# Altium project BACKPMAN21.PrjPcb (part 1 of 3)
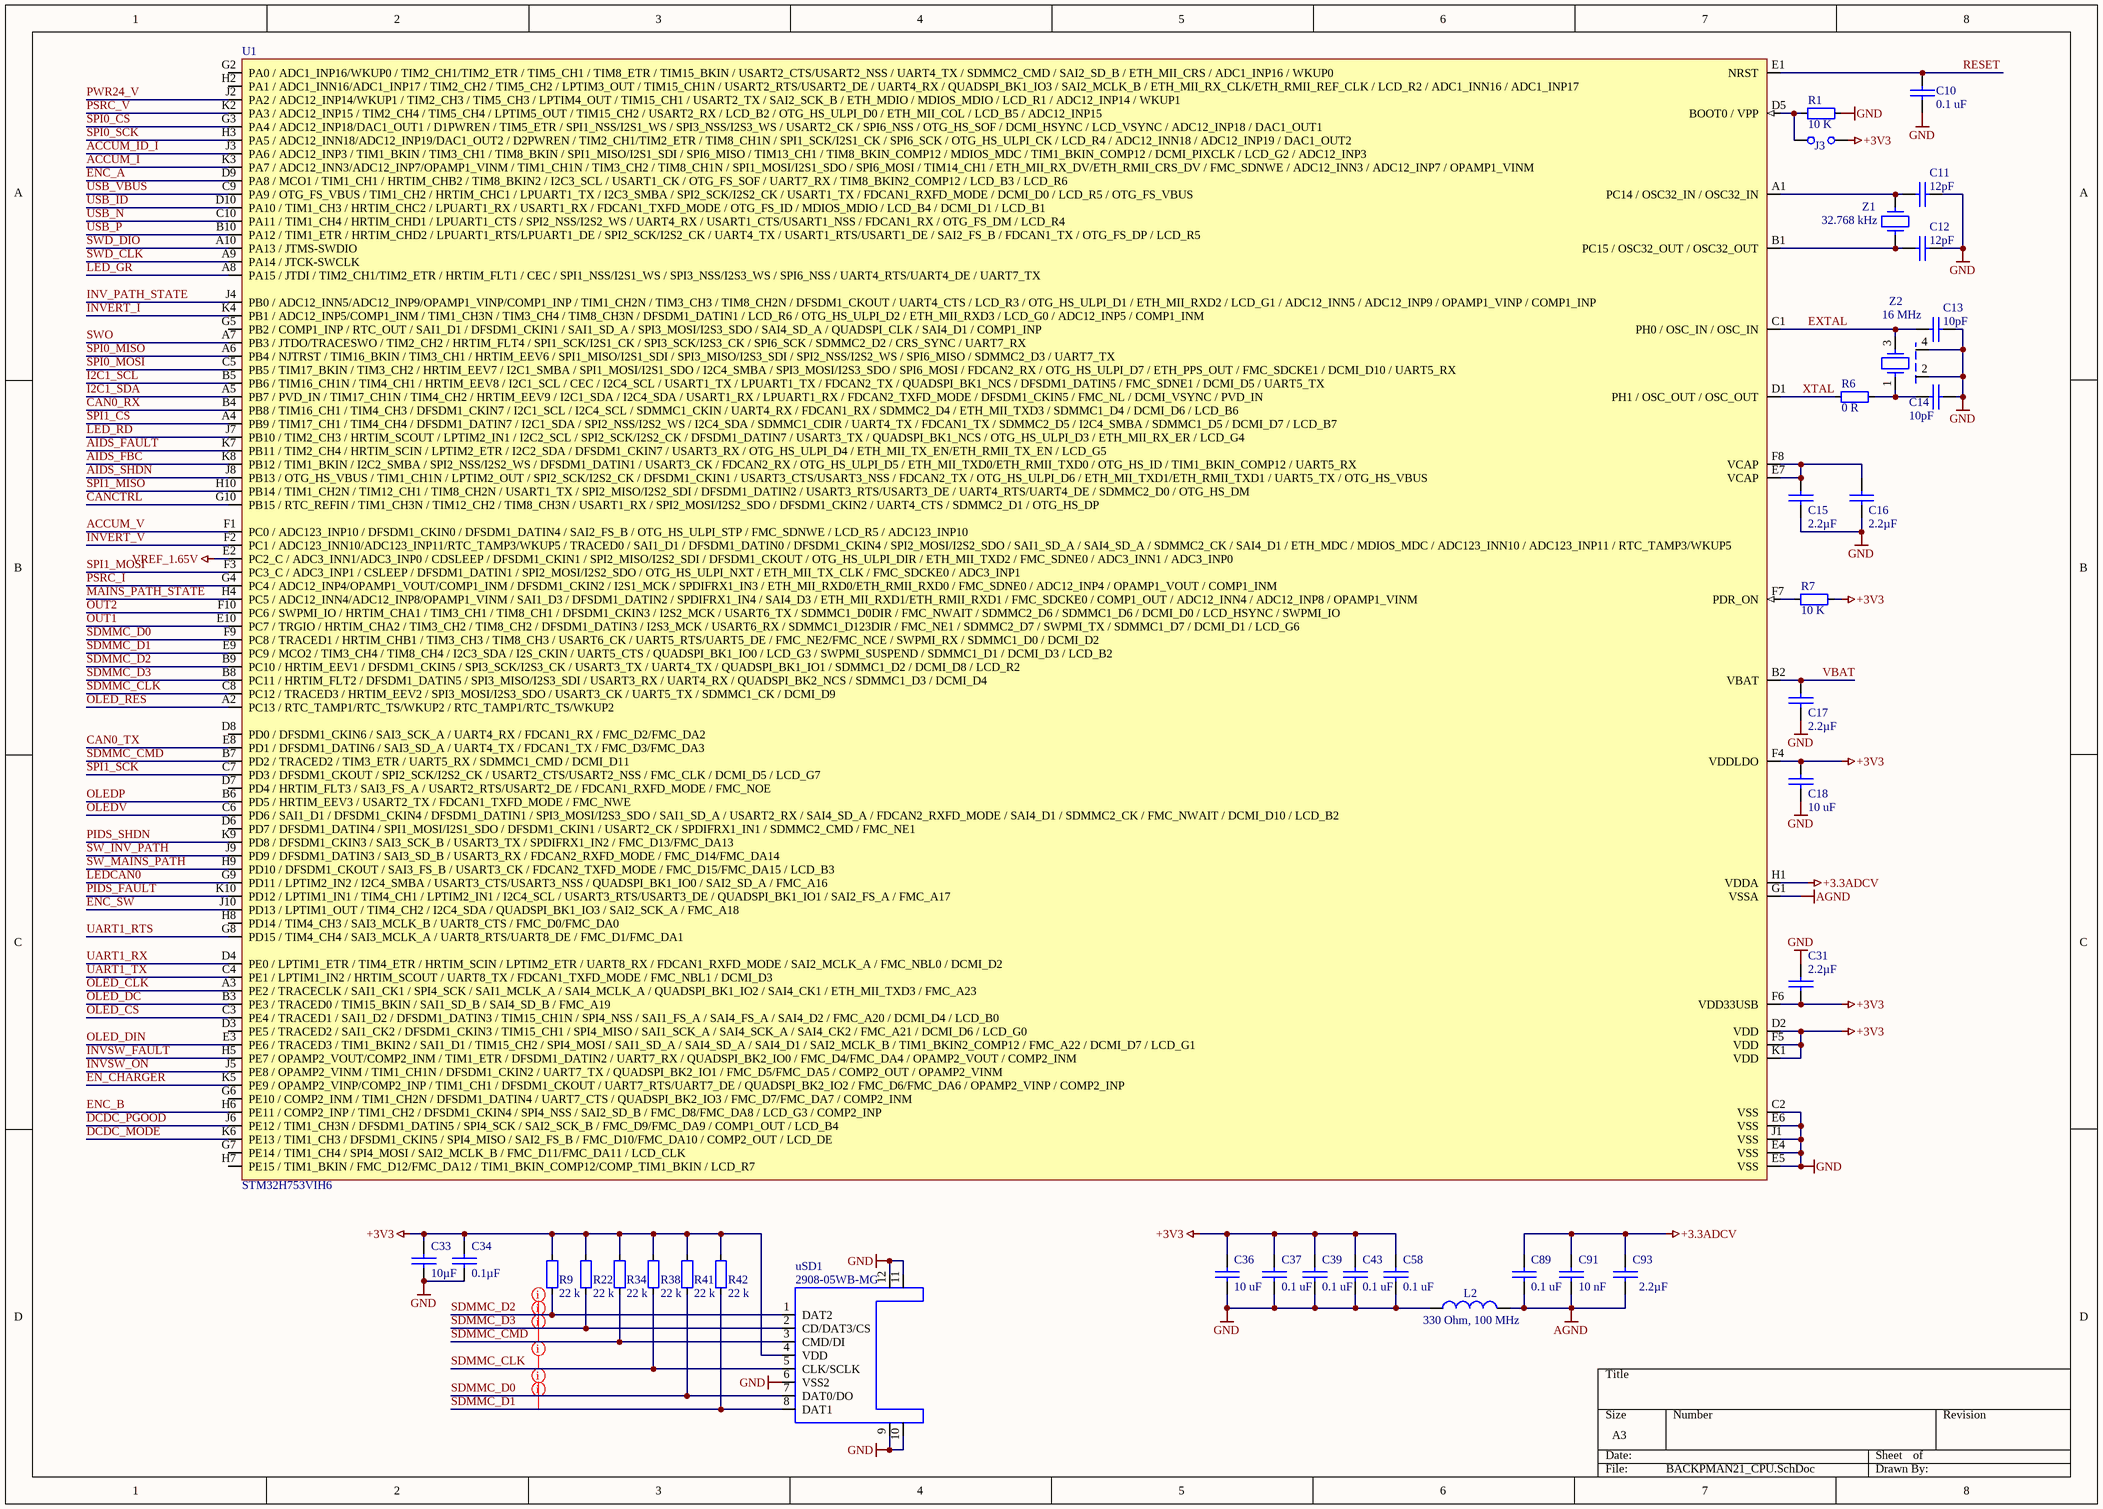
[diagram p0: BACKPMAN21_CPU.SchDoc]
4 sheets, 353 parts. Net scope: global (net labels, ports and power ports of the same name join across sheets).
Board file: BACKPMANv21.PcbDoc
Sheets:
  BACKPMAN21_CPU.SchDoc
  BACKPMAN21_Intfs.SchDoc
  BACKPMAN21_Charger.SchDoc
  BACKPMAN21_PwrSw.SchDoc

## Sheet BACKPMAN21_CPU.SchDoc
size A3

### Parts
C10  value 0.1 uF  [1608[0603]]  (hidden comment: CL10B104KA8NNND)
C11  value 12pF  [0402 CAP]  (hidden comment: Capacitor)
C12  value 12pF  [0402 CAP]  (hidden comment: Capacitor)
C13  value 10pF  [0402 CAP]  (hidden comment: Capacitor)
C14  value 10pF  [0402 CAP]  (hidden comment: Capacitor)
C15  value 2.2µF  [0603 CAP]  (hidden comment: Capacitor)
C16  value 2.2µF  [0603 CAP]  (hidden comment: Capacitor)
C17  value 2.2µF  [0603 CAP]  (hidden comment: Capacitor)
C18  value 10 uF  [0805-1206]  (hidden comment: LMK212F106ZG-T)
C31  value 2.2µF  [0603 CAP]  (hidden comment: Capacitor)
C33  value 10µF  [0603 CAP]  (hidden comment: Capacitor)
C34  value 0.1µF  [0402 CAP]  (hidden comment: Capacitor)
C36  value 10 uF  [0805-1206]  (hidden comment: LMK212F106ZG-T)
C37  value 0.1 uF  [1608[0603]]  (hidden comment: CL10B104KA8NNND)
C39  value 0.1 uF  [1608[0603]]  (hidden comment: CL10B104KA8NNND)
C43  value 0.1 uF  [1608[0603]]  (hidden comment: CL10B104KA8NNND)
C58  value 0.1 uF  [1608[0603]]  (hidden comment: CL10B104KA8NNND)
C89  value 0.1 uF  [1608[0603]]  (hidden comment: CL10B104KA8NNND)
C91  value 10 nF  [1608[0603]]  (hidden comment: CVNF010K0603)
C93  value 2.2µF  [0603 CAP]  (hidden comment: Capacitor)
J3  PH1-02-TA-HT  [HDR1X2V]  (value not drawn)
L2  value 330 Ohm, 100 MHz  [0603]  (hidden comment: BLM18SG331TN1D)
R1  value 10 K  [0603]  (hidden comment: RL0603K010-1)
R6  value 0 R  [0603]  (hidden comment: RC0603FR-070RL)
R7  value 10 K  [0603]  (hidden comment: RL0603K010-1)
R9  value 22 k  [0402]  (hidden comment: Resistor)
R22  value 22 k  [0402]  (hidden comment: Resistor)
R34  value 22 k  [0402]  (hidden comment: Resistor)
R38  value 22 k  [0402]  (hidden comment: Resistor)
R41  value 22 k  [0402]  (hidden comment: Resistor)
R42  value 22 k  [0402]  (hidden comment: Resistor)
U1  STM32H753VIH6  [TFBGA100]
uSD1  2908-05WB-MG  [2908-05WB-MG]
Z1  value 32.768 kHz  [ABS7]  (hidden comment: ABS07-32.768KHZ-T)
Z2  value 16 MHz  [4-SMD 2.00mm x 1.60mm]  (hidden comment: ABM11-16.000MHZ-9-B1U-T)

### Nets
+3.3ADCV: C89.2 C91.1 C93.1 U1.H1(VDDA)
+3V3: C18.2 C31.2 C33.2 C34.2 C36.2 C37.2 C39.2 C43.2 C58.2 J3.2 R7.1 R9.2 R22.2 R34.2 R38.2 R41.2 R42.2 U1.D2(VDD) U1.F4(VDDLDO) U1.F5(VDD) U1.F6(VDD33USB) U1.K1(VDD) uSD1.4(VDD)
AGND: C89.1 C91.2 C93.2 L2.2 U1.G1(VSSA)
GND: C10.2 C11.2 C12.2 C13.2 C14.2 C15.2 C16.2 C17.2 C18.1 C31.1 C33.1 C34.1 C36.1 C37.1 C39.1 C43.1 C58.1 L2.1 R1.1 U1.C2(VSS) U1.E4(VSS) U1.E5(VSS) U1.E6(VSS) U1.J1(VSS) uSD1.6(VSS2) uSD1.9 uSD1.10(WP) uSD1.11(GND) uSD1.12(GND) Z2.2 Z2.4
VREF_1.65V: U1.E2(PC2_C_/_ADC3_INN1/ADC3_INP0_/_CDSLEEP_/_DFSDM1_CKIN1_/_SPI2_MISO/I2S2_SDI_/_DFSDM1_CKOUT_/_OTG_HS_ULPI_DIR_/_ETH_MII_TXD2_/_FMC_SDNE0_/_ADC3_INN1_/_ADC3_INP0)
ACCUM_I: U1.K3(PA7_/_ADC12_INN3/ADC12_INP7/OPAMP1_VINM_/_TIM1_CH1N_/_TIM3_CH2_/_TIM8_CH1N_/_SPI1_MOSI/I2S1_SDO_/_SPI6_MOSI_/_TIM14_CH1_/_ETH_MII_RX_DV/ETH_RMII_CRS_DV_/_FMC_SDNWE_/_ADC12_INN3_/_ADC12_INP7_/_OPAMP1_VINM)
ACCUM_ID_I: U1.J3(PA6_/_ADC12_INP3_/_TIM1_BKIN_/_TIM3_CH1_/_TIM8_BKIN_/_SPI1_MISO/I2S1_SDI_/_SPI6_MISO_/_TIM13_CH1_/_TIM8_BKIN_COMP12_/_MDIOS_MDC_/_TIM1_BKIN_COMP12_/_DCMI_PIXCLK_/_LCD_G2_/_ADC12_INP3)
ACCUM_V: U1.F1(PC0_/_ADC123_INP10_/_DFSDM1_CKIN0_/_DFSDM1_DATIN4_/_SAI2_FS_B_/_OTG_HS_ULPI_STP_/_FMC_SDNWE_/_LCD_R5_/_ADC123_INP10)
AIDS_FAULT: U1.K7(PB11_/_TIM2_CH4_/_HRTIM_SCIN_/_LPTIM2_ETR_/_I2C2_SDA_/_DFSDM1_CKIN7_/_USART3_RX_/_OTG_HS_ULPI_D4_/_ETH_MII_TX_EN/ETH_RMII_TX_EN_/_LCD_G5)
AIDS_FBC: U1.K8(PB12_/_TIM1_BKIN_/_I2C2_SMBA_/_SPI2_NSS/I2S2_WS_/_DFSDM1_DATIN1_/_USART3_CK_/_FDCAN2_RX_/_OTG_HS_ULPI_D5_/_ETH_MII_TXD0/ETH_RMII_TXD0_/_OTG_HS_ID_/_TIM1_BKIN_COMP12_/_UART5_RX)
AIDS_SHDN: U1.J8(PB13_/_OTG_HS_VBUS_/_TIM1_CH1N_/_LPTIM2_OUT_/_SPI2_SCK/I2S2_CK_/_DFSDM1_CKIN1_/_USART3_CTS/USART3_NSS_/_FDCAN2_TX_/_OTG_HS_ULPI_D6_/_ETH_MII_TXD1/ETH_RMII_TXD1_/_UART5_TX_/_OTG_HS_VBUS)
CAN0_RX: U1.B4(PB8_/_TIM16_CH1_/_TIM4_CH3_/_DFSDM1_CKIN7_/_I2C1_SCL_/_I2C4_SCL_/_SDMMC1_CKIN_/_UART4_RX_/_FDCAN1_RX_/_SDMMC2_D4_/_ETH_MII_TXD3_/_SDMMC1_D4_/_DCMI_D6_/_LCD_B6)
CAN0_TX: U1.E8(PD1_/_DFSDM1_DATIN6_/_SAI3_SD_A_/_UART4_TX_/_FDCAN1_TX_/_FMC_D3/FMC_DA3)
CANCTRL: U1.G10(PB15_/_RTC_REFIN_/_TIM1_CH3N_/_TIM12_CH2_/_TIM8_CH3N_/_USART1_RX_/_SPI2_MOSI/I2S2_SDO_/_DFSDM1_CKIN2_/_UART4_CTS_/_SDMMC2_D1_/_OTG_HS_DP)
DCDC_MODE: U1.K6(PE13_/_TIM1_CH3_/_DFSDM1_CKIN5_/_SPI4_MISO_/_SAI2_FS_B_/_FMC_D10/FMC_DA10_/_COMP2_OUT_/_LCD_DE)
DCDC_PGOOD: U1.J6(PE12_/_TIM1_CH3N_/_DFSDM1_DATIN5_/_SPI4_SCK_/_SAI2_SCK_B_/_FMC_D9/FMC_DA9_/_COMP1_OUT_/_LCD_B4)
EN_CHARGER: U1.K5(PE9_/_OPAMP2_VINP/COMP2_INP_/_TIM1_CH1_/_DFSDM1_CKOUT_/_UART7_RTS/UART7_DE_/_QUADSPI_BK2_IO2_/_FMC_D6/FMC_DA6_/_OPAMP2_VINP_/_COMP2_INP)
ENC_A: U1.D9(PA8_/_MCO1_/_TIM1_CH1_/_HRTIM_CHB2_/_TIM8_BKIN2_/_I2C3_SCL_/_USART1_CK_/_OTG_FS_SOF_/_UART7_RX_/_TIM8_BKIN2_COMP12_/_LCD_B3_/_LCD_R6)
ENC_B: U1.H6(PE11_/_COMP2_INP_/_TIM1_CH2_/_DFSDM1_CKIN4_/_SPI4_NSS_/_SAI2_SD_B_/_FMC_D8/FMC_DA8_/_LCD_G3_/_COMP2_INP)
ENC_SW: U1.J10(PD13_/_LPTIM1_OUT_/_TIM4_CH2_/_I2C4_SDA_/_QUADSPI_BK1_IO3_/_SAI2_SCK_A_/_FMC_A18)
EXTAL: C13.1 U1.C1(PH0_/_OSC_IN_/_OSC_IN) Z2.3
I2C1_SCL: U1.B5(PB6_/_TIM16_CH1N_/_TIM4_CH1_/_HRTIM_EEV8_/_I2C1_SCL_/_CEC_/_I2C4_SCL_/_USART1_TX_/_LPUART1_TX_/_FDCAN2_TX_/_QUADSPI_BK1_NCS_/_DFSDM1_DATIN5_/_FMC_SDNE1_/_DCMI_D5_/_UART5_TX)
I2C1_SDA: U1.A5(PB7_/_PVD_IN_/_TIM17_CH1N_/_TIM4_CH2_/_HRTIM_EEV9_/_I2C1_SDA_/_I2C4_SDA_/_USART1_RX_/_LPUART1_RX_/_FDCAN2_TXFD_MODE_/_DFSDM1_CKIN5_/_FMC_NL_/_DCMI_VSYNC_/_PVD_IN)
INV_PATH_STATE: U1.J4(PB0_/_ADC12_INN5/ADC12_INP9/OPAMP1_VINP/COMP1_INP_/_TIM1_CH2N_/_TIM3_CH3_/_TIM8_CH2N_/_DFSDM1_CKOUT_/_UART4_CTS_/_LCD_R3_/_OTG_HS_ULPI_D1_/_ETH_MII_RXD2_/_LCD_G1_/_ADC12_INN5_/_ADC12_INP9_/_OPAMP1_VINP_/_COMP1_INP)
INVERT_I: U1.K4(PB1_/_ADC12_INP5/COMP1_INM_/_TIM1_CH3N_/_TIM3_CH4_/_TIM8_CH3N_/_DFSDM1_DATIN1_/_LCD_R6_/_OTG_HS_ULPI_D2_/_ETH_MII_RXD3_/_LCD_G0_/_ADC12_INP5_/_COMP1_INM)
INVERT_V: U1.F2(PC1_/_ADC123_INN10/ADC123_INP11/RTC_TAMP3/WKUP5_/_TRACED0_/_SAI1_D1_/_DFSDM1_DATIN0_/_DFSDM1_CKIN4_/_SPI2_MOSI/I2S2_SDO_/_SAI1_SD_A_/_SAI4_SD_A_/_SDMMC2_CK_/_SAI4_D1_/_ETH_MDC_/_MDIOS_MDC_/_ADC123_INN10_/_ADC123_INP11_/_RTC_TAMP3/WKUP5)
INVSW_FAULT: U1.H5(PE7_/_OPAMP2_VOUT/COMP2_INM_/_TIM1_ETR_/_DFSDM1_DATIN2_/_UART7_RX_/_QUADSPI_BK2_IO0_/_FMC_D4/FMC_DA4_/_OPAMP2_VOUT_/_COMP2_INM)
INVSW_ON: U1.J5(PE8_/_OPAMP2_VINM_/_TIM1_CH1N_/_DFSDM1_CKIN2_/_UART7_TX_/_QUADSPI_BK2_IO1_/_FMC_D5/FMC_DA5_/_COMP2_OUT_/_OPAMP2_VINM)
LED_GR: U1.A8(PA15_/_JTDI_/_TIM2_CH1/TIM2_ETR_/_HRTIM_FLT1_/_CEC_/_SPI1_NSS/I2S1_WS_/_SPI3_NSS/I2S3_WS_/_SPI6_NSS_/_UART4_RTS/UART4_DE_/_UART7_TX)
LED_RD: U1.J7(PB10_/_TIM2_CH3_/_HRTIM_SCOUT_/_LPTIM2_IN1_/_I2C2_SCL_/_SPI2_SCK/I2S2_CK_/_DFSDM1_DATIN7_/_USART3_TX_/_QUADSPI_BK1_NCS_/_OTG_HS_ULPI_D3_/_ETH_MII_RX_ER_/_LCD_G4)
LEDCAN0: U1.G9(PD11_/_LPTIM2_IN2_/_I2C4_SMBA_/_USART3_CTS/USART3_NSS_/_QUADSPI_BK1_IO0_/_SAI2_SD_A_/_FMC_A16)
MAINS_PATH_STATE: U1.H4(PC5_/_ADC12_INN4/ADC12_INP8/OPAMP1_VINM_/_SAI1_D3_/_DFSDM1_DATIN2_/_SPDIFRX1_IN4_/_SAI4_D3_/_ETH_MII_RXD1/ETH_RMII_RXD1_/_FMC_SDCKE0_/_COMP1_OUT_/_ADC12_INN4_/_ADC12_INP8_/_OPAMP1_VINM)
OLED_CLK: U1.A3(PE2_/_TRACECLK_/_SAI1_CK1_/_SPI4_SCK_/_SAI1_MCLK_A_/_SAI4_MCLK_A_/_QUADSPI_BK1_IO2_/_SAI4_CK1_/_ETH_MII_TXD3_/_FMC_A23)
OLED_CS: U1.C3(PE4_/_TRACED1_/_SAI1_D2_/_DFSDM1_DATIN3_/_TIM15_CH1N_/_SPI4_NSS_/_SAI1_FS_A_/_SAI4_FS_A_/_SAI4_D2_/_FMC_A20_/_DCMI_D4_/_LCD_B0)
OLED_DC: U1.B3(PE3_/_TRACED0_/_TIM15_BKIN_/_SAI1_SD_B_/_SAI4_SD_B_/_FMC_A19)
OLED_DIN: U1.E3(PE6_/_TRACED3_/_TIM1_BKIN2_/_SAI1_D1_/_TIM15_CH2_/_SPI4_MOSI_/_SAI1_SD_A_/_SAI4_SD_A_/_SAI4_D1_/_SAI2_MCLK_B_/_TIM1_BKIN2_COMP12_/_FMC_A22_/_DCMI_D7_/_LCD_G1)
OLED_RES: U1.A2(PC13_/_RTC_TAMP1/RTC_TS/WKUP2_/_RTC_TAMP1/RTC_TS/WKUP2)
OLEDP: U1.B6(PD5_/_HRTIM_EEV3_/_USART2_TX_/_FDCAN1_TXFD_MODE_/_FMC_NWE)
OLEDV: U1.C6(PD6_/_SAI1_D1_/_DFSDM1_CKIN4_/_DFSDM1_DATIN1_/_SPI3_MOSI/I2S3_SDO_/_SAI1_SD_A_/_USART2_RX_/_SAI4_SD_A_/_FDCAN2_RXFD_MODE_/_SAI4_D1_/_SDMMC2_CK_/_FMC_NWAIT_/_DCMI_D10_/_LCD_B2)
OUT1: U1.E10(PC7_/_TRGIO_/_HRTIM_CHA2_/_TIM3_CH2_/_TIM8_CH2_/_DFSDM1_DATIN3_/_I2S3_MCK_/_USART6_RX_/_SDMMC1_D123DIR_/_FMC_NE1_/_SDMMC2_D7_/_SWPMI_TX_/_SDMMC1_D7_/_DCMI_D1_/_LCD_G6)
OUT2: U1.F10(PC6_/_SWPMI_IO_/_HRTIM_CHA1_/_TIM3_CH1_/_TIM8_CH1_/_DFSDM1_CKIN3_/_I2S2_MCK_/_USART6_TX_/_SDMMC1_D0DIR_/_FMC_NWAIT_/_SDMMC2_D6_/_SDMMC1_D6_/_DCMI_D0_/_LCD_HSYNC_/_SWPMI_IO)
PIDS_FAULT: U1.K10(PD12_/_LPTIM1_IN1_/_TIM4_CH1_/_LPTIM2_IN1_/_I2C4_SCL_/_USART3_RTS/USART3_DE_/_QUADSPI_BK1_IO1_/_SAI2_FS_A_/_FMC_A17)
PIDS_SHDN: U1.K9(PD8_/_DFSDM1_CKIN3_/_SAI3_SCK_B_/_USART3_TX_/_SPDIFRX1_IN2_/_FMC_D13/FMC_DA13)
PSRC_I: U1.G4(PC4_/_ADC12_INP4/OPAMP1_VOUT/COMP1_INM_/_DFSDM1_CKIN2_/_I2S1_MCK_/_SPDIFRX1_IN3_/_ETH_MII_RXD0/ETH_RMII_RXD0_/_FMC_SDNE0_/_ADC12_INP4_/_OPAMP1_VOUT_/_COMP1_INM)
PSRC_V: U1.K2(PA3_/_ADC12_INP15_/_TIM2_CH4_/_TIM5_CH4_/_LPTIM5_OUT_/_TIM15_CH2_/_USART2_RX_/_LCD_B2_/_OTG_HS_ULPI_D0_/_ETH_MII_COL_/_LCD_B5_/_ADC12_INP15)
PWR24_V: U1.J2(PA2_/_ADC12_INP14/WKUP1_/_TIM2_CH3_/_TIM5_CH3_/_LPTIM4_OUT_/_TIM15_CH1_/_USART2_TX_/_SAI2_SCK_B_/_ETH_MDIO_/_MDIOS_MDIO_/_LCD_R1_/_ADC12_INP14_/_WKUP1)
RESET: C10.1 U1.E1(NRST)
SDMMC_CLK: R38.1 U1.C8(PC12_/_TRACED3_/_HRTIM_EEV2_/_SPI3_MOSI/I2S3_SDO_/_USART3_CK_/_UART5_TX_/_SDMMC1_CK_/_DCMI_D9) uSD1.5(CLK/SCLK)
SDMMC_CMD: R34.1 U1.B7(PD2_/_TRACED2_/_TIM3_ETR_/_UART5_RX_/_SDMMC1_CMD_/_DCMI_D11) uSD1.3(CMD/DI)
SDMMC_D0: R41.1 U1.F9(PC8_/_TRACED1_/_HRTIM_CHB1_/_TIM3_CH3_/_TIM8_CH3_/_USART6_CK_/_UART5_RTS/UART5_DE_/_FMC_NE2/FMC_NCE_/_SWPMI_RX_/_SDMMC1_D0_/_DCMI_D2) uSD1.7(DAT0/DO)
SDMMC_D1: R42.1 U1.E9(PC9_/_MCO2_/_TIM3_CH4_/_TIM8_CH4_/_I2C3_SDA_/_I2S_CKIN_/_UART5_CTS_/_QUADSPI_BK1_IO0_/_LCD_G3_/_SWPMI_SUSPEND_/_SDMMC1_D1_/_DCMI_D3_/_LCD_B2) uSD1.8(DAT1)
SDMMC_D2: R9.1 U1.B9(PC10_/_HRTIM_EEV1_/_DFSDM1_CKIN5_/_SPI3_SCK/I2S3_CK_/_USART3_TX_/_UART4_TX_/_QUADSPI_BK1_IO1_/_SDMMC1_D2_/_DCMI_D8_/_LCD_R2) uSD1.1(DAT2)
SDMMC_D3: R22.1 U1.B8(PC11_/_HRTIM_FLT2_/_DFSDM1_DATIN5_/_SPI3_MISO/I2S3_SDI_/_USART3_RX_/_UART4_RX_/_QUADSPI_BK2_NCS_/_SDMMC1_D3_/_DCMI_D4) uSD1.2(CD/DAT3/CS)
SPI0_CS: U1.G3(PA4_/_ADC12_INP18/DAC1_OUT1_/_D1PWREN_/_TIM5_ETR_/_SPI1_NSS/I2S1_WS_/_SPI3_NSS/I2S3_WS_/_USART2_CK_/_SPI6_NSS_/_OTG_HS_SOF_/_DCMI_HSYNC_/_LCD_VSYNC_/_ADC12_INP18_/_DAC1_OUT1)
SPI0_MISO: U1.A6(PB4_/_NJTRST_/_TIM16_BKIN_/_TIM3_CH1_/_HRTIM_EEV6_/_SPI1_MISO/I2S1_SDI_/_SPI3_MISO/I2S3_SDI_/_SPI2_NSS/I2S2_WS_/_SPI6_MISO_/_SDMMC2_D3_/_UART7_TX)
SPI0_MOSI: U1.C5(PB5_/_TIM17_BKIN_/_TIM3_CH2_/_HRTIM_EEV7_/_I2C1_SMBA_/_SPI1_MOSI/I2S1_SDO_/_I2C4_SMBA_/_SPI3_MOSI/I2S3_SDO_/_SPI6_MOSI_/_FDCAN2_RX_/_OTG_HS_ULPI_D7_/_ETH_PPS_OUT_/_FMC_SDCKE1_/_DCMI_D10_/_UART5_RX)
SPI0_SCK: U1.H3(PA5_/_ADC12_INN18/ADC12_INP19/DAC1_OUT2_/_D2PWREN_/_TIM2_CH1/TIM2_ETR_/_TIM8_CH1N_/_SPI1_SCK/I2S1_CK_/_SPI6_SCK_/_OTG_HS_ULPI_CK_/_LCD_R4_/_ADC12_INN18_/_ADC12_INP19_/_DAC1_OUT2)
SPI1_CS: U1.A4(PB9_/_TIM17_CH1_/_TIM4_CH4_/_DFSDM1_DATIN7_/_I2C1_SDA_/_SPI2_NSS/I2S2_WS_/_I2C4_SDA_/_SDMMC1_CDIR_/_UART4_TX_/_FDCAN1_TX_/_SDMMC2_D5_/_I2C4_SMBA_/_SDMMC1_D5_/_DCMI_D7_/_LCD_B7)
SPI1_MISO: U1.H10(PB14_/_TIM1_CH2N_/_TIM12_CH1_/_TIM8_CH2N_/_USART1_TX_/_SPI2_MISO/I2S2_SDI_/_DFSDM1_DATIN2_/_USART3_RTS/USART3_DE_/_UART4_RTS/UART4_DE_/_SDMMC2_D0_/_OTG_HS_DM)
SPI1_MOSI: U1.F3(PC3_C_/_ADC3_INP1_/_CSLEEP_/_DFSDM1_DATIN1_/_SPI2_MOSI/I2S2_SDO_/_OTG_HS_ULPI_NXT_/_ETH_MII_TX_CLK_/_FMC_SDCKE0_/_ADC3_INP1)
SPI1_SCK: U1.C7(PD3_/_DFSDM1_CKOUT_/_SPI2_SCK/I2S2_CK_/_USART2_CTS/USART2_NSS_/_FMC_CLK_/_DCMI_D5_/_LCD_G7)
SW_INV_PATH: U1.J9(PD9_/_DFSDM1_DATIN3_/_SAI3_SD_B_/_USART3_RX_/_FDCAN2_RXFD_MODE_/_FMC_D14/FMC_DA14)
SW_MAINS_PATH: U1.H9(PD10_/_DFSDM1_CKOUT_/_SAI3_FS_B_/_USART3_CK_/_FDCAN2_TXFD_MODE_/_FMC_D15/FMC_DA15_/_LCD_B3)
SWD_CLK: U1.A9(PA14_/_JTCK-SWCLK)
SWD_DIO: U1.A10(PA13_/_JTMS-SWDIO)
SWO: U1.A7(PB3_/_JTDO/TRACESWO_/_TIM2_CH2_/_HRTIM_FLT4_/_SPI1_SCK/I2S1_CK_/_SPI3_SCK/I2S3_CK_/_SPI6_SCK_/_SDMMC2_D2_/_CRS_SYNC_/_UART7_RX)
UART1_RTS: U1.G8(PD15_/_TIM4_CH4_/_SAI3_MCLK_A_/_UART8_RTS/UART8_DE_/_FMC_D1/FMC_DA1)
UART1_RX: U1.D4(PE0_/_LPTIM1_ETR_/_TIM4_ETR_/_HRTIM_SCIN_/_LPTIM2_ETR_/_UART8_RX_/_FDCAN1_RXFD_MODE_/_SAI2_MCLK_A_/_FMC_NBL0_/_DCMI_D2)
UART1_TX: U1.C4(PE1_/_LPTIM1_IN2_/_HRTIM_SCOUT_/_UART8_TX_/_FDCAN1_TXFD_MODE_/_FMC_NBL1_/_DCMI_D3)
USB_ID: U1.D10(PA10_/_TIM1_CH3_/_HRTIM_CHC2_/_LPUART1_RX_/_USART1_RX_/_FDCAN1_TXFD_MODE_/_OTG_FS_ID_/_MDIOS_MDIO_/_LCD_B4_/_DCMI_D1_/_LCD_B1)
USB_N: U1.C10(PA11_/_TIM1_CH4_/_HRTIM_CHD1_/_LPUART1_CTS_/_SPI2_NSS/I2S2_WS_/_UART4_RX_/_USART1_CTS/USART1_NSS_/_FDCAN1_RX_/_OTG_FS_DM_/_LCD_R4)
USB_P: U1.B10(PA12_/_TIM1_ETR_/_HRTIM_CHD2_/_LPUART1_RTS/LPUART1_DE_/_SPI2_SCK/I2S2_CK_/_UART4_TX_/_USART1_RTS/USART1_DE_/_SAI2_FS_B_/_FDCAN1_TX_/_OTG_FS_DP_/_LCD_R5)
USB_VBUS: U1.C9(PA9_/_OTG_FS_VBUS_/_TIM1_CH2_/_HRTIM_CHC1_/_LPUART1_TX_/_I2C3_SMBA_/_SPI2_SCK/I2S2_CK_/_USART1_TX_/_FDCAN1_RXFD_MODE_/_DCMI_D0_/_LCD_R5_/_OTG_FS_VBUS)
VBAT: C17.1 U1.B2(VBAT)
XTAL: R6.2 U1.D1(PH1_/_OSC_OUT_/_OSC_OUT)
NetC11_1: C11.1 U1.A1(PC14_/_OSC32_IN_/_OSC32_IN) Z1.2
NetC12_1: C12.1 U1.B1(PC15_/_OSC32_OUT_/_OSC32_OUT) Z1.1
NetC14_1: C14.1 R6.1 Z2.1
NetC15_1: C15.1 C16.1 U1.E7(VCAP) U1.F8(VCAP)
NetJ3_1: J3.1 R1.2 U1.D5(BOOT0_/_VPP)
NetR7_2: R7.2 U1.F7(PDR_ON)

Not connected (* = marked no-connect by the designer): U1 D3(PE5_/_TRACED2_/_SAI1_CK2_/_DFSDM1_CKIN3_/_TIM15_CH1_/_SPI4_MISO_/_SAI1_SCK_A_/_SAI4_SCK_A_/_SAI4_CK2_/_FMC_A21_/_DCMI_D6_/_LCD_G0) D6(PD7_/_DFSDM1_DATIN4_/_SPI1_MOSI/I2S1_SDO_/_DFSDM1_CKIN1_/_USART2_CK_/_SPDIFRX1_IN1_/_SDMMC2_CMD_/_FMC_NE1) D7(PD4_/_HRTIM_FLT3_/_SAI3_FS_A_/_USART2_RTS/USART2_DE_/_FDCAN1_RXFD_MODE_/_FMC_NOE) D8(PD0_/_DFSDM1_CKIN6_/_SAI3_SCK_A_/_UART4_RX_/_FDCAN1_RX_/_FMC_D2/FMC_DA2) G2(PA0_/_ADC1_INP16/WKUP0_/_TIM2_CH1/TIM2_ETR_/_TIM5_CH1_/_TIM8_ETR_/_TIM15_BKIN_/_USART2_CTS/USART2_NSS_/_UART4_TX_/_SDMMC2_CMD_/_SAI2_SD_B_/_ETH_MII_CRS_/_ADC1_INP16_/_WKUP0) G5(PB2_/_COMP1_INP_/_RTC_OUT_/_SAI1_D1_/_DFSDM1_CKIN1_/_SAI1_SD_A_/_SPI3_MOSI/I2S3_SDO_/_SAI4_SD_A_/_QUADSPI_CLK_/_SAI4_D1_/_COMP1_INP) G6(PE10_/_COMP2_INM_/_TIM1_CH2N_/_DFSDM1_DATIN4_/_UART7_CTS_/_QUADSPI_BK2_IO3_/_FMC_D7/FMC_DA7_/_COMP2_INM) G7(PE14_/_TIM1_CH4_/_SPI4_MOSI_/_SAI2_MCLK_B_/_FMC_D11/FMC_DA11_/_LCD_CLK) H2(PA1_/_ADC1_INN16/ADC1_INP17_/_TIM2_CH2_/_TIM5_CH2_/_LPTIM3_OUT_/_TIM15_CH1N_/_USART2_RTS/USART2_DE_/_UART4_RX_/_QUADSPI_BK1_IO3_/_SAI2_MCLK_B_/_ETH_MII_RX_CLK/ETH_RMII_REF_CLK_/_LCD_R2_/_ADC1_INN16_/_ADC1_INP17) H7(PE15_/_TIM1_BKIN_/_FMC_D12/FMC_DA12_/_TIM1_BKIN_COMP12/COMP_TIM1_BKIN_/_LCD_R7) H8(PD14_/_TIM4_CH3_/_SAI3_MCLK_B_/_UART8_CTS_/_FMC_D0/FMC_DA0)

### Layout directives
net class uSD: SDMMC_CLK, SDMMC_CMD, SDMMC_D0, SDMMC_D1, SDMMC_D2, SDMMC_D3

### Library data of the parts
C10 C37 C39 C43 C58 C89 = CVNF100K0603-25: 0.1 uF, 50V, 10% , X7R,  0603 SMD MLC Capacitor; Manufacturer: WALSIN; PartNum: 2496834; PartName: 0603B104K500CT; Tolerance: ±10%; Distributor: Farnell; Voltage: 50 V
C11 C12 = 0402N120G500CT: 12pF, ±2%, 50V, C0G, NP0, 0402 (1005 Metric), -55°C ~ 125°C, -, General Purpose; Manufacturer: Walsin Technology Corporation; PartNum: 1292-1250-1-ND; Voltage - Rated: 50V; Part Number: 0402N120G500CT; Distributor: Digi-Key; PartName: 0402N120G500CT; Price: 0.10000; Tolerance: ±2%; Temperature Coefficient: C0G, NP0; Operating Temperature: -55°C ~ 125°C; Features: -; Package / Case: 0402 (1005 Metric)
C13 C14 = GCM1555C1H100FA16D: 10pF, ±1%, 50V, C0G, NP0, 0402 (1005 Metric), -55°C ~ 125°C, -, Automotive; Manufacturer: Murata Electronics North America; PartNum: 490-14348-1-ND; Voltage - Rated: 50V; Part Number: GCM1555C1H100FA16D; Distributor: Digi-Key; PartName: GCM1555C1H100FA16D; Price: 0.15000; Tolerance: ±1%; Temperature Coefficient: C0G, NP0; Operating Temperature: -55°C ~ 125°C; Features: -; Package / Case: 0402 (1005 Metric)
C15-C17 C31 C93 = CC0603KRX5R7BB225: 2.2µF, ±10%, 16V, X5R, 0603 (1608 Metric), -55°C ~ 85°C, -, General Purpose; Manufacturer: Yageo; PartNum: 311-1784-1-ND; Part Number: CC0603KRX5R7BB225; Distributor: Digi-Key; PartName: CC0603KRX5R7BB225; Price: 0.07420; Tolerance: ±10%; Voltage - Rated: 16V; Temperature Coefficient: X5R; Operating Temperature: -55°C ~ 85°C; Features: -; Package / Case: 0603 (1608 Metric)
C18 C36 = LMK212F106ZG-T: CAP CER 10UF 10V 10% X5R 0805; Manufacturer: Taiyo Yuden; PartNum: 587-2668-1-ND; PartName: LMK212B7106KG-TD; Distributor: Digi-Key; Price: 0.102$; Tolerance: 10%; Voltage: 10V
C33 = GRT188R61C106KE13D: 10µF, ±10%, 16V, X5R, 0603 (1608 Metric), -55°C ~ 85°C, -, Automotive; Manufacturer: Murata Electronics North America; PartNum: 490-12317-1-ND; Voltage - Rated: 16V; Part Number: GRT188R61C106KE13D; Distributor: Digi-Key; PartName: GRT188R61C106KE13D; Price: 0.22770; Tolerance: ±10%; Temperature Coefficient: X5R; Operating Temperature: -55°C ~ 85°C; Features: -; Package / Case: 0603 (1608 Metric)
C34 = 0402B104K500CT: 0.1µF, ±10%, 50V, X7R, 0402 (1005 Metric), -55°C ~ 125°C, -, General Purpose; Manufacturer: Walsin Technology Corporation; PartNum: 1292-1176-1-ND; Voltage - Rated: 50V; Part Number: 0402B104K500CT; Distributor: Digi-Key; PartName: 0402B104K500CT; Price: 0.19000; Tolerance: ±10%; Temperature Coefficient: X7R; Operating Temperature: -55°C ~ 125°C; Features: -; Package / Case: 0402 (1005 Metric)
C91 = CVNF010K0603: 10 nF, 50V, 10%, X7R, 0603 SMD MLC Capacitor; Manufacturer: Murata Electronics; PartNum: 490-1512-1-ND; PartName: GRM188R71H103KA01D; Tolerance: ±10%; Distributor: Digi-Key; Voltage: 50 V
J3 = Jumper: 2 Pos. 2.54 mm Single Row Through Hole Straight Pin Header; Manufacturer: ADAM TECH; Distributor: Future; Price: 0.02 Euro; PartNum: PH1-02-TA-HT; PartName: PH1-02-TA-HT; Price50: 0.02 Euro; Price100: 0.02 Euro; Price1000: 0.02 Euro
L2 = BLM18SG331TN1D: Ferrite bead, 330 Ohm, 100 MHz,  1.5 A, 0.07 Ohm; Manufacturer: Murata Electronics North America; Tolerance: 25%; Distributor: Future; Price: 0.03 Euro; PartNum: BLM18SG331TN1D; PartName: BLM18SG331TN1D
R1 R7 = RL0603K010-1: 10 K, 1%, 0603, SMD Resistor, Taped; Manufacturer: Vishay; Voltage: 75 V; Distributor: Schukat; Price: 0.002 Euro; Tolerance: 1%; PartNum: RL0603K010-1
R6 = RC0603FR-070RL: 0 R, Jumper, 0603, SMD Resistor, -55°C ~ 155°C; Manufacturer: Yageo; PartNum: 311-0.0HRCT-ND; Voltage: 75 V; Distributor: Digi-Key; Price: 0.005$; PartName: RC0603FR-070RL
R9 R22 R34 R38 R41 R42 = RMCF0402FT22K0: 22 kOhms, ±1%, 0.063W, 1/16W, Thick Film, ±100ppm/°C, 0402 (1005 Metric), -55°C ~ 155°C, Automotive AEC-Q200; Manufacturer: Stackpole Electronics Inc; PartNum: RMCF0402FT22K0CT-ND; Voltage: 75V; Distributor: Digi-Key; Price: 0.10000; Tolerance: ±1%; PartName: RMCF0402FT22K0; Part Number: RMCF0402FT22K0; Temperature Coefficient: ±100ppm/°C; Operating Temperature: -55°C ~ 155°C; Power (Watts): 0.063W, 1/16W; Features: Automotive AEC-Q200; Package / Case: 0402 (1005 Metric)
U1 = STM32H753VIH6: Cortex-M7, 480MHz 2MB FLASH, 1MB RAM, 100-TFBGA (8x8); Manufacturer: STMicroelectronics; PartNum: STM32H753VIH6-ND; Distributor: Digi-Key; PartName: STM32H753VIH6; Price: 9.89$
uSD1 = 2908-05WB-MG: microSD cadr holder; Manufacturer: 3M; Price: 2.71$; Distributor: Farnell; PartNum: 2908-05WB-MG; PartName: 2908-05WB-MG
Z1 = ABS07-32.768KHZ-T: 32.768 kHz, 12.5 pF, 70 kOhm, ±20ppm, 3.2 x 1.5 mm, -40°C ~ 85°C; Manufacturer: Abracon Corporation; PartNum: 535-9542-1-ND; Price: 1.09$; Distributor: Digi-Key; Tolerance: 20 ppm; PartName: ABS07-32.768KHZ-T
Z2 = ABM11-16.000MHZ-9-B1U-T: 16 MHz, 9 pF, ±10ppm, 2.00mm x 1.60mm, -20°C ~ 70°C; Manufacturer: Abracon LLC; PartNum: 535-13598-1-ND; Price: 0.98 $; Distributor: Digi-Key; Tolerance: 10 ppm; PartName: ABM11-16.000MHZ-9-B1U-T; Supplier 1: Digi-Key; Supplier Part Number 1: 535-13598-2-ND

## Sheet BACKPMAN21_Intfs.SchDoc
size A3
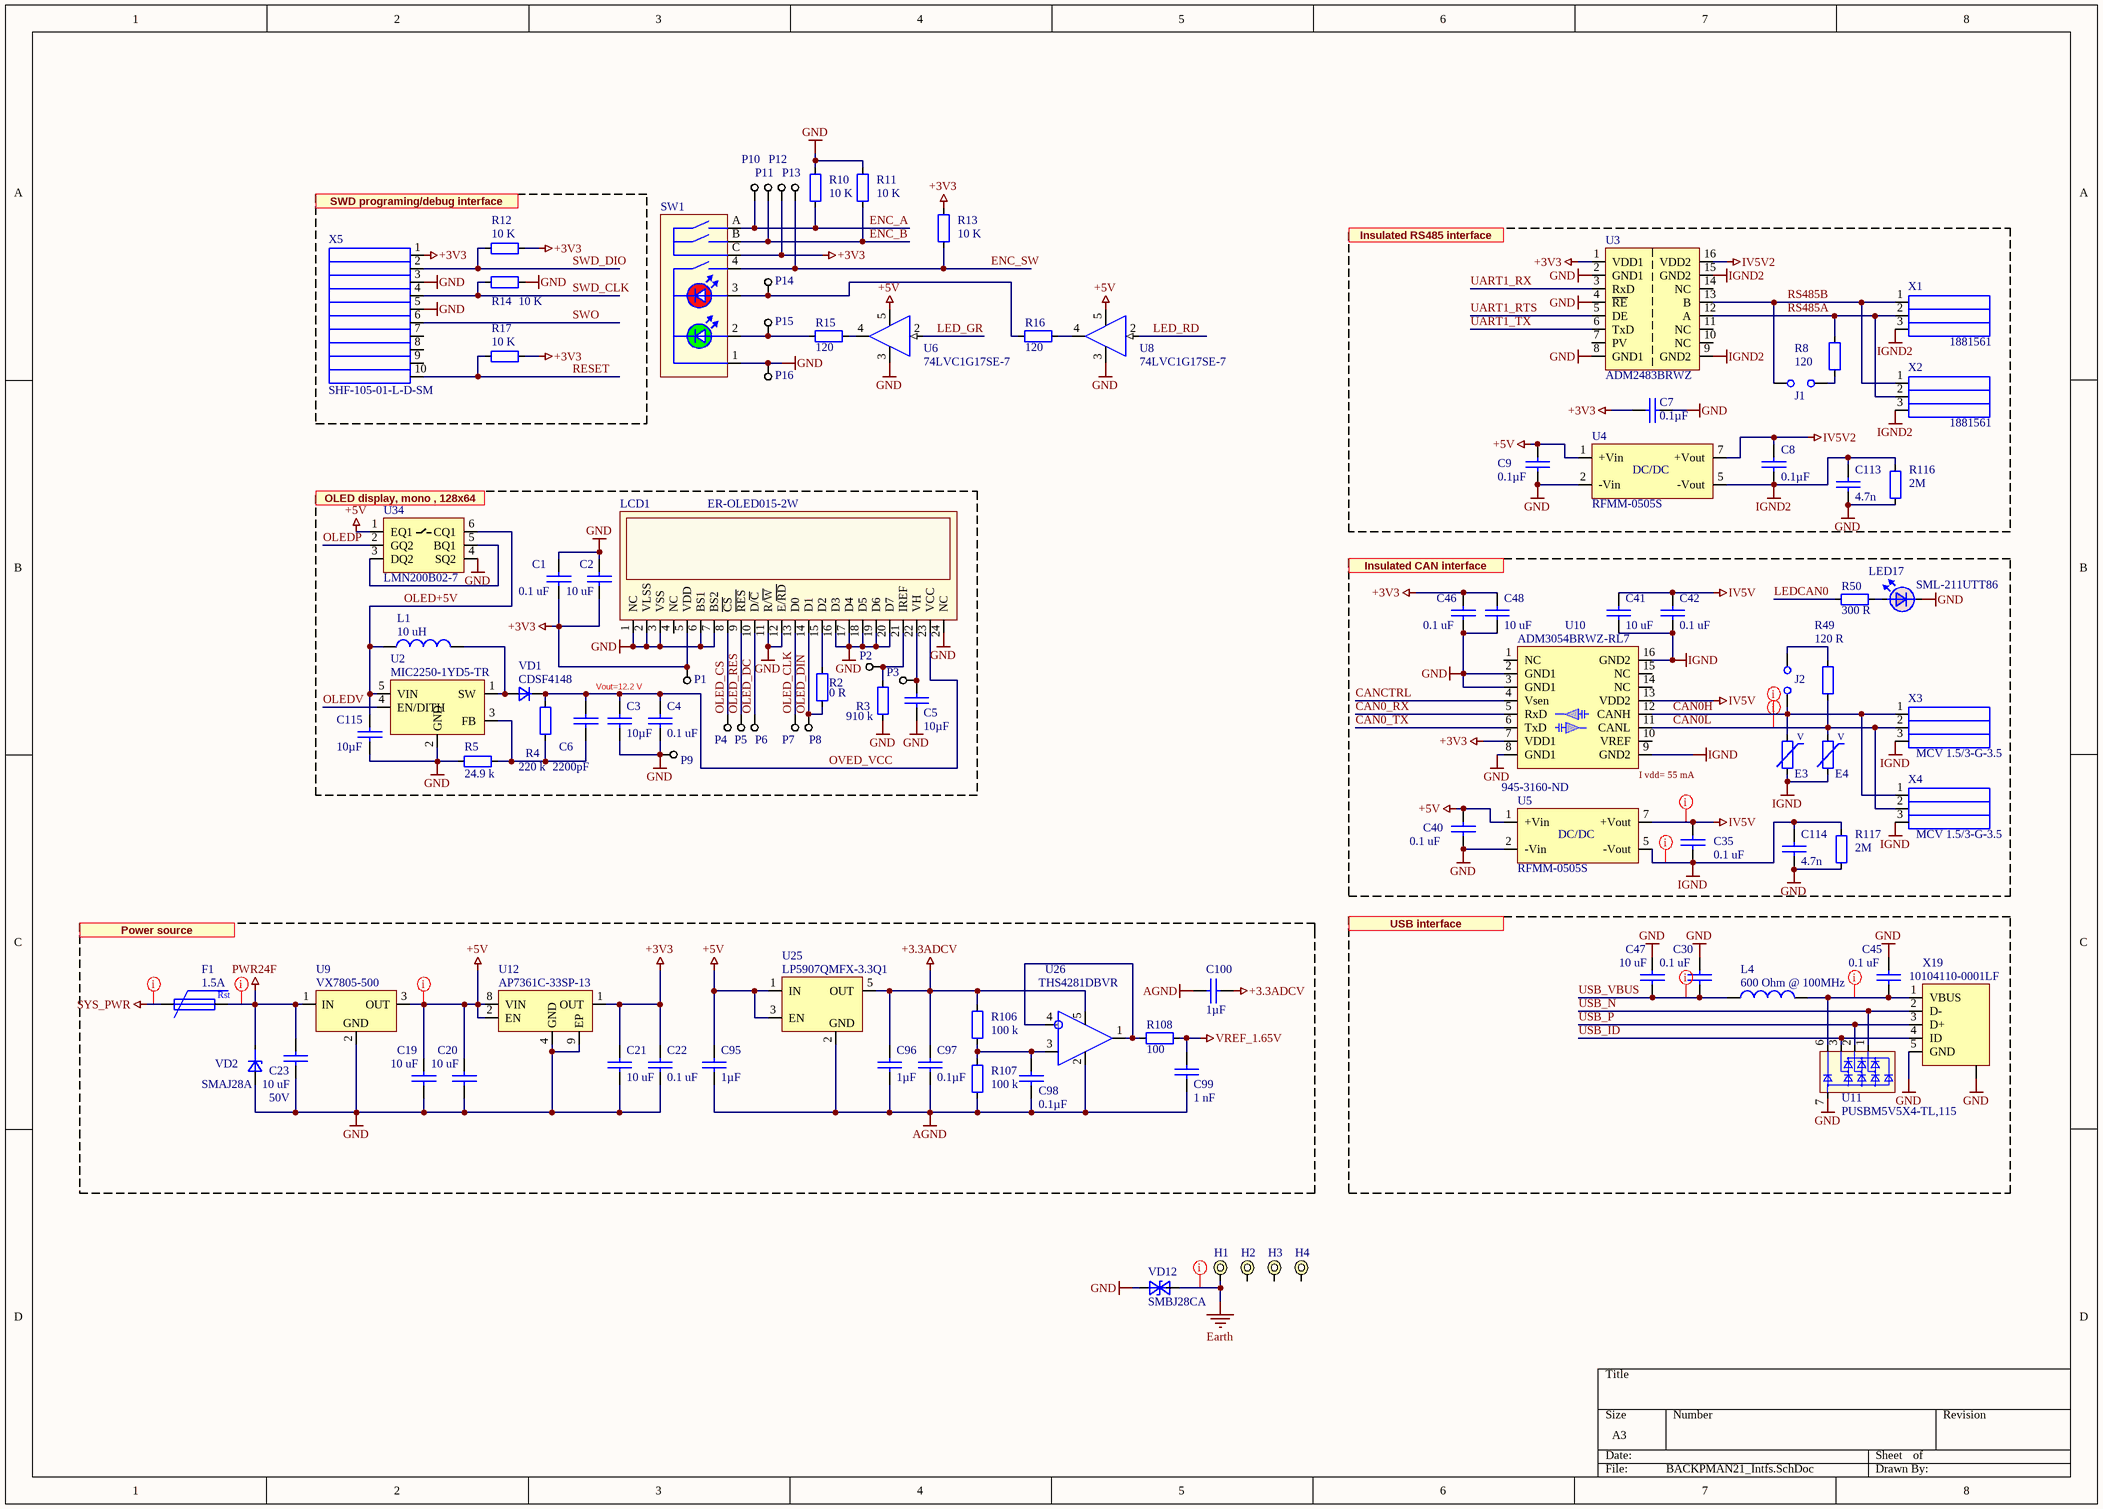
[diagram p1: BACKPMAN21_Intfs.SchDoc]

### Parts
C1  value 0.1 uF  [1608[0603]]  (hidden comment: CL10B104KA8NNND)
C2  value 10 uF  [0805-1206]  (hidden comment: LMK212F106ZG-T)
C3  value 10µF  [0805 CAP]  (hidden comment: Capacitor)
C4  value 0.1 uF  [1608[0603]]  (hidden comment: CL10B104KA8NNND)
C5  value 10µF  [0805 CAP]  (hidden comment: Capacitor)
C6  value 2200pF  [0603 CAP]  (hidden comment: Capacitor)
C7  value 0.1µF  [0603 CAP]  (hidden comment: Capacitor)
C8  value 0.1µF  [0603 CAP]  (hidden comment: Capacitor)
C9  value 0.1µF  [0603 CAP]  (hidden comment: Capacitor)
C19  value 10 uF  [0805-1206]  (hidden comment: LMK212F106ZG-T)
C20  value 10 uF  [0805-1206]  (hidden comment: LMK212F106ZG-T)
C21  value 10 uF  [0805-1206]  (hidden comment: LMK212F106ZG-T)
C22  value 0.1 uF  [1608[0603]]  (hidden comment: CL10B104KA8NNND)
C23  value 10 uF  Voltage: 50V  [3225[1210]]  (hidden comment: GRM32DF51H106ZA01L)
C30  value 0.1 uF  [1608[0603]]  (hidden comment: CL10B104KA8NNND)
C35  value 0.1 uF  [1608[0603]]  (hidden comment: CL10B104KA8NNND)
C40  value 0.1 uF  [1608[0603]]  (hidden comment: CL10B104KA8NNND)
C41  value 10 uF  [0805-1206]  (hidden comment: LMK212F106ZG-T)
C42  value 0.1 uF  [1608[0603]]  (hidden comment: CL10B104KA8NNND)
C45  value 0.1 uF  [1608[0603]]  (hidden comment: CL10B104KA8NNND)
C46  value 0.1 uF  [1608[0603]]  (hidden comment: CL10B104KA8NNND)
C47  value 10 uF  [0805-1206]  (hidden comment: GRM21BR60J106KE19L)
C48  value 10 uF  [0805-1206]  (hidden comment: LMK212F106ZG-T)
C95  value 1µF  [0603 CAP]  (hidden comment: Capacitor)
C96  value 1µF  [0603 CAP]  (hidden comment: Capacitor)
C97  value 0.1µF  [0603 CAP]  (hidden comment: Capacitor)
C98  value 0.1µF  [0603 CAP]  (hidden comment: Capacitor)
C99  value 1 nF  [0603 CAP]  (hidden comment: Capacitor)
C100  value 1µF  [0603 CAP]  (hidden comment: Capacitor)
C113  value 4.7n  [0805 CAP]  (hidden comment: C0805V472KDRACTU)
C114  value 4.7n  [0805 CAP]  (hidden comment: C0805V472KDRACTU)
C115  value 10µF  [0805 CAP]  (hidden comment: Capacitor)
E3  823 560 505 60  [0603]  (value not drawn)
E4  823 560 505 60  [0603]  (value not drawn)
F1  value 1.5A  [2920 (7351 Metric)]  (hidden comment: 0ZCF0075AF2C)
H1  Hole 5MM Plated  [HOLE_5MM plated]  (value not drawn)  (no BOM)
H2  Hole 5MM Plated  [HOLE_5MM plated]  (value not drawn)  (no BOM)
H3  Hole 5MM Plated  [HOLE_5MM plated]  (value not drawn)  (no BOM)
H4  Hole 5MM Plated  [HOLE_5MM plated]  (value not drawn)  (no BOM)
J1  PH1-02-TA-HT  [HDR1X2V]  (value not drawn)
J2  PH1-02-TA-HT  [HDR1X2V]  (value not drawn)
L1  value 10 uH  [VLS4012ET]  (hidden comment: VLS4012ET-100M)
L4  value 600 Ohm @ 100MHz  [0805]  (hidden comment: MPZ2012S601AT000)
LCD1  ER-OLED015-2W  [ER-OLED015-2]
LED17  SML-211UTT86  [0805 LED]
P1  Pin 0.9 mm  [Pin 0.9 mm]  (value not drawn)  (net tie, no BOM)
P2  Pin 0.9 mm  [Pin 0.9 mm]  (value not drawn)  (net tie, no BOM)
P3  Pin 0.9 mm  [Pin 0.9 mm]  (value not drawn)  (net tie, no BOM)
P4  Pin 0.9 mm  [Pin 0.9 mm]  (value not drawn)  (net tie, no BOM)
P5  Pin 0.9 mm  [Pin 0.9 mm]  (value not drawn)  (net tie, no BOM)
P6  Pin 0.9 mm  [Pin 0.9 mm]  (value not drawn)  (net tie, no BOM)
P7  Pin 0.9 mm  [Pin 0.9 mm]  (value not drawn)  (net tie, no BOM)
P8  Pin 0.9 mm  [Pin 0.9 mm]  (value not drawn)  (net tie, no BOM)
P9  Pin 0.9 mm  [Pin 0.9 mm]  (value not drawn)  (net tie, no BOM)
P10  Pin 0.9 mm  [Pin 0.9 mm]  (value not drawn)  (net tie, no BOM)
P11  Pin 0.9 mm  [Pin 0.9 mm]  (value not drawn)  (net tie, no BOM)
P12  Pin 0.9 mm  [Pin 0.9 mm]  (value not drawn)  (net tie, no BOM)
P13  Pin 0.9 mm  [Pin 0.9 mm]  (value not drawn)  (net tie, no BOM)
P14  Pin 0.9 mm  [Pin 0.9 mm]  (value not drawn)  (net tie, no BOM)
P15  Pin 0.9 mm  [Pin 0.9 mm]  (value not drawn)  (net tie, no BOM)
P16  Pin 0.9 mm  [Pin 0.9 mm]  (value not drawn)  (net tie, no BOM)
R2  value 0 R  [0603]  (hidden comment: RC0603FR-070RL)
R3  value 910 k  [0603]  (hidden comment: Resistor)
R4  value 220 k  [0603]  (hidden comment: Resistor)
R5  value 24.9 k  [0603]  (hidden comment: Resistor)
R8  value 120  [0603]  (hidden comment: Resistor)
R10  value 10 K  [0603]  (hidden comment: RL0603K010-1)
R11  value 10 K  [0603]  (hidden comment: RL0603K010-1)
R12  value 10 K  [0603]  (hidden comment: RL0603K010-1)
R13  value 10 K  [0603]  (hidden comment: RL0603K010-1)
R14  value 10 K  [0603]  (hidden comment: RL0603K010-1)
R15  value 120  [0603]  (hidden comment: Resistor)
R16  value 120  [0603]  (hidden comment: Resistor)
R17  value 10 K  [0603]  (hidden comment: RL0603K010-1)
R49  value 120 R  [0603]  (hidden comment: RL0603E120-1)
R50  value 300 R  [0603]  (hidden comment: CRCW0603300RFKEA)
R106  value 100 k  [0603]  (hidden comment: Resistor)
R107  value 100 k  [0603]  (hidden comment: Resistor)
R108  value 100  [0603]  (hidden comment: Resistor)
R116  value 2M  [1206]  (hidden comment: RCV12062M00FKEA)
R117  value 2M  [1206]  (hidden comment: RCV12062M00FKEA)
SW1  PEL12D-4225S-S2024  [PEL12D-4225S-S2024]  (value not drawn)
U2  MIC2250-1YD5-TR  [SOT23-5]
U3  ADM2483BRWZ  [SO-G16/D10.4]
U4  RFMM-0505S  [Recom 7-SIP module]
U5  RFMM-0505S  Supplier Part Number 1: 945-3160-ND  [Recom 7-SIP module]
U6  74LVC1G17SE-7  [SOT-353 ON Semi]
U8  74LVC1G17SE-7  [SOT-353 ON Semi]
U9  VX7805-500  [VX7805-500]
U10  ADM3054BRWZ-RL7  [SO-G16/D10.4]
U11  PUSBM5V5X4-TL,115  [DFN1616-6]
U12  AP7361C-33SP-13  [SOIC-8 EDP]
U25  LP5907QMFX-3.3Q1  [SOT23-5]
U26  THS4281DBVR  [SOT23-5]
U34  LMN200B02-7  [SOT363]
VD1  CDSF4148  [1005]
VD2  SMAJ28A  [SMA]
VD12  SMBJ28CA  [DO-214AA_SMBJ BI]
X1  1881561  [1881561]
X2  1881561  [1881561]
X3  MCV 1.5/3-G-3.5  [mcv1.5-3-g_3.5 green + MC 1,5 3-ST-3,5 - 1840379]
X4  MCV 1.5/3-G-3.5  [mcv1.5-3-g_3.5 green + MC 1,5 3-ST-3,5 - 1840379]
X5  SHF-105-01-L-D-SM  [SHF-105-01-L-D-SM]
X19  10104110-0001LF  [FCI micro USB B receptacle SMD]

### Blocks framed on the sheet
Vout=12.2 V: C1-C6 C115 L1 LCD1 P1-P9 R2-R5 U2 U34 VD1
I vdd= 55 mA: C35 C40-C42 C46 C48 C114 E3 E4 J2 LED17 R49 R50 R117 U5 U10 X3 X4

### Nets
+3.3ADCV: C96.2 C97.1 C100.1 R106.2 U25.5(OUT) U26.5(V+)
+3V3: C1.2 C2.1 C7.1 C21.2 C22.2 C46.2 C48.2 LCD1.5(VDD) P1.1 P12.1 R12.2 R13.2 R17.2 SW1.C U3.1(VDD1) U10.7(VDD1) U12.1(OUT) X5.1
+5V: C9.2 C19.2 C20.2 C40.2 C95.2 U4.1(+Vin) U5.1(+Vin) U6.5(VCC) U8.5(VCC) U9.3(OUT) U12.2(EN) U12.8(VIN) U25.1(IN) U25.3(EN) U34.1(EQ1)
AGND: C95.1 C96.1 C97.2 C98.2 C99.2 C100.2 R107.1 U25.2(GND) U26.2(GND)
Earth: H1.0 VD12.2(A)
GND: C1.1 C2.2 C3.2 C4.1 C5.2 C7.2 C9.1 C19.1 C20.1 C21.1 C22.1 C23.2 C30.2 C40.1 C45.2 C46.1 C47.2 C48.1 C113.2 C114.2 C115.2 LCD1.1(NC) LCD1.2(VLSS) LCD1.3(VSS) LCD1.6(BS1) LCD1.7(BS2) LCD1.11(R/~{W}) LCD1.12(E/~{RD}) LCD1.16(D3) LCD1.17(D4) LCD1.18(D5) LCD1.19(D6) LCD1.20(D7) LCD1.24(NC) LED17.2 P9.1 P16.1 R3.1 R5.2 R10.2 R11.2 R14.2 R116.1 R117.1 SW1.1 U2.2(GND) U3.2(GND1) U3.4(~{RE}) U3.8(GND1) U4.2(-Vin) U5.2(-Vin) U6.3(GND) U8.3(GND) U9.2(GND) U10.2(GND1) U10.3(GND1) U10.8(GND1) U11.7 U12.4(GND) U12.9(EP) U34.4(SQ2) VD2.2 VD12.1(C) X5.3 X5.5 X19.5(GND) X19.G1(CASE)
IGND: C35.1 C41.1 C42.1 C114.1 E3.1 E4.1 R117.2 U5.5(-Vout) U10.9(GND2) U10.16(GND2) X3.3 X4.3
IGND2: C8.1 C113.1 R116.2 U3.9(GND2) U3.15(GND2) U4.5(-Vout) X1.3 X2.3
IV5V: C35.2 C41.2 C42.2 U5.7(+Vout) U10.13(VDD2)
IV5V2: C8.2 U3.16(VDD2) U4.7(+Vout)
PWR24F: C23.1 F1.2 U9.1(IN) VD2.1
SYS_PWR: F1.1
VREF_1.65V: C99.1 R108.1
CAN0_RX: U10.5(RxD)
CAN0_TX: U10.6(TxD)
CAN0H: E3.2 J2.2 U10.12(CANH) X3.1 X4.1
CAN0L: E4.2 R49.1 U10.11(CANL) X3.2 X4.2
CANCTRL: U10.4(Vsen)
ENC_A: P10.1 R10.1 SW1.A
ENC_B: P11.1 R11.1 SW1.B
ENC_SW: P13.1 R13.1 SW1.4
LED_GR: U6.2(A)
LED_RD: U8.2(A)
LEDCAN0: R50.2
OLED+5V: C115.1 L1.1 U2.5(VIN) U34.6(CQ1)
OLED_CLK: LCD1.13(D0) P7.1
OLED_CS: LCD1.8(~{CS}) P4.1
OLED_DC: LCD1.10(D/~{C}) P6.1
OLED_DIN: LCD1.14(D1) P8.1 R2.1
OLED_RES: LCD1.9(~{RES}) P5.1
OLEDP: U34.2(GQ2)
OLEDV: U2.4(EN/DITH)
OVED_VCC: C3.1 C4.2 C6.1 LCD1.23(VCC) R4.2 VD1.1
RESET: R17.1 X5.10
RS485A: R8.2 U3.12(A) X1.2 X2.2
RS485B: J1.1 U3.13(B) X1.1 X2.1
SWD_CLK: R14.1 X5.4
SWD_DIO: R12.1 X5.2
SWO: X5.6
UART1_RTS: U3.5(DE)
UART1_RX: U3.3(RxD)
UART1_TX: U3.6(TxD)
USB_ID: U11.3 X19.4(ID)
USB_N: U11.1 X19.2(D-)
USB_P: U11.2 X19.3(D+)
USB_VBUS: C30.1 C47.1 L4.2
NetC5_1: C5.1 LCD1.22(VH) P3.1
NetC6_2: C6.2 R4.1 R5.1 U2.3(FB)
NetC45_1: C45.1 L4.1 U11.6 X19.1(VBUS)
NetC98_1: C98.1 R106.1 R107.2 U26.3(IN+)
NetJ1_2: J1.2 R8.1
NetJ2_1: J2.1 R49.2
NetL1_2: L1.2 U2.1(SW) VD1.2
NetLCD1_15: LCD1.15(D2) R2.2
NetLCD1_21: LCD1.21(IREF) P2.1 R3.2
NetLED17_1: LED17.1 R50.1
NetP14_1: P14.1 R16.2 SW1.3
NetP15_1: P15.1 R15.2 SW1.2
NetR15_1: R15.1 U6.4(Y)
NetR16_1: R16.1 U8.4(Y)
NetR108_2: R108.2 U26.1(OUT) U26.4(IN-)
NetU34_3: U34.3(DQ2) U34.5(BQ1)

Not connected (* = marked no-connect by the designer): H2 0; H3 0; H4 0; LCD1 4(NC); U3 7(PV) 10(NC) 11(NC) 14(NC); U10 1(NC) 10(VREF) 14(NC) 15(NC); X5 7 8 9

### Layout directives
net class 24V: Earth, PWR24F, SYS_PWR
net class Isol: CAN0H, CAN0L, IGND, IV5V
net class 5V: +5V, NetC45_1, USB_VBUS

### Notes on the sheet
- SWD programing/debug interface
- Insulated RS485 interface
- (near U34) OLED display, mono , 128x64
- Insulated CAN interface
- Power source
- USB interface
- (in symbol 0ZCF0075AF2C) Rst
- (in symbol 823 560 501 01) V
- (in symbol RFMM-0505S) DC/DC

### Library data of the parts
C1 C4 C22 C30 C35 C40 C42 C45 C46 = CVNF100K0603-25: as C10 on sheet BACKPMAN21_CPU; Tolerance: ±10%; Distributor: Farnell; Voltage: 50 V
C2 C19-C21 C41 C48 = LMK212F106ZG-T: as C18 on sheet BACKPMAN21_CPU; Distributor: Digi-Key; Tolerance: 10%; Voltage: 10V
  C19-C21: Price: 0.102$
C3 C5 C115 = TMK212BBJ106KG-T: 10µF, ±10%, 25V, X5R, 0805 (2012 Metric), -55°C ~ 85°C, -, General Purpose; Manufacturer: Taiyo Yuden; PartNum: 587-2985-1-ND; Part Number: TMK212BBJ106KG-T; Distributor: Digi-Key; PartName: TMK212BBJ106KG-T; Price: 0.26000; Tolerance: ±10%; Voltage - Rated: 25V; Temperature Coefficient: X5R; Operating Temperature: -55°C ~ 85°C; Features: -; Package / Case: 0805 (2012 Metric)
C6 = CC0603KRX7R8BB222: 2200pF, ±10%, 25V, X7R, 0603 (1608 Metric), -55°C ~ 125°C, -, General Purpose; Manufacturer: Yageo; PartNum: 311-3653-1-ND; Part Number: CC0603KRX7R8BB222; Distributor: Digi-Key; PartName: CC0603KRX7R8BB222; Price: 0.01610; Tolerance: ±10%; Voltage - Rated: 25V; Temperature Coefficient: X7R; Operating Temperature: -55°C ~ 125°C; Features: -; Package / Case: 0603 (1608 Metric)
C7-C9 = CL10B104KO8NNNC: 0.1µF, ±10%, 16V, X7R, 0603 (1608 Metric), -55°C ~ 125°C, -, General Purpose; Manufacturer: Samsung Electro-Mechanics; PartNum: 1276-1005-1-ND; Voltage - Rated: 16V; Part Number: CL10B104KO8NNNC; Distributor: Digi-Key; PartName: CL10B104KO8NNNC; Price: 0.01480; Tolerance: ±10%; Temperature Coefficient: X7R; Operating Temperature: -55°C ~ 125°C; Features: -; Package / Case: 0603 (1608 Metric)
C23 = GRM32DF51H106ZA01L: 10uF, 50V, 20%, Y5V (F), 1210; Manufacturer: Taiyo Yuden; PartNum: 587-2225-2-ND; PartName: UMK325BJ106MM-T; Tolerance: 20%; Price: 0.16$; Distributor: Digi-Key
C47 = GRM21BR60J106KE19L: 10 uF, 6.3V, X5R, 10%, 0805; Manufacturer: Murata; PartNum: 490-1717-1-ND; Distributor: Digi-Key; Price: 0.4$; Tolerance: 10%; Voltage: 6.3V; PartName: GRM21BR60J106KE19L
C95 C96 C100 = EMK107BJ105KA-T: 1µF, ±10%, 16V, X5R, 0603 (1608 Metric), -55°C ~ 85°C, -, General Purpose; Manufacturer: Taiyo Yuden; PartNum: 587-1251-1-ND; Voltage - Rated: 16V; Part Number: EMK107BJ105KA-T; Distributor: Digi-Key; PartName: EMK107BJ105KA-T; Price: 0.02330; Tolerance: ±10%; Temperature Coefficient: X5R; Operating Temperature: -55°C ~ 85°C; Features: -; Package / Case: 0603 (1608 Metric)
C97 C98 = GCM188L81H104KA57D: 0.1µF, ±10%, 50V, X8L, 0603 (1608 Metric), -55°C ~ 150°C, -, Automotive; Manufacturer: Murata Electronics North America; PartNum: 490-6049-1-ND; Voltage - Rated: 50V; Part Number: GCM188L81H104KA57D; Distributor: Digi-Key; PartName: GCM188L81H104KA57D; Price: 0.06240; Tolerance: ±10%; Temperature Coefficient: X8L; Operating Temperature: -55°C ~ 150°C; Features: -; Package / Case: 0603 (1608 Metric)
C99 = CC0603JRX7R9BB102: 1000pF, ±5%, 50V, X7R, 0603 (1608 Metric), -55°C ~ 125°C, -, General Purpose; Manufacturer: Yageo; PartNum: 311-3361-1-ND; Voltage - Rated: 50V; Part Number: CC0603JRX7R9BB102; Distributor: Digi-Key; PartName: CC0603JRX7R9BB102; Price: 0.01920; Tolerance: ±5%; Temperature Coefficient: X7R; Operating Temperature: -55°C ~ 125°C; Features: -; Package / Case: 0603 (1608 Metric)
C113 C114 = C0805V472KDRACTU: 4700pF ±10% 1000V (1kV) Ceramic Capacitor X7R 0805 (2012 Metric),-55°C ~ 125°C; Manufacturer: KEMET; PartNum: 399-6470-1-ND; Distributor: Digi-Key; Tolerance: 10%; PartName: C0805V472KDRACTU; Price: 0.3$; Voltage: 1000V
E3 E4 = 823 560 501 01: SUPPRESSOR ESD 5VDC, 56pF,  0603, -40..+85C; Manufacturer: Würth Elektronik; Voltage: 5V; Distributor: Würth Elektronik; PartNum: 823 560 505 60; PartName: 823 560 505 60
F1 = 0ZCF0075AF2C: PTC RESETTABLE 60V 750MA, It=1.5A, 0.3s 2920(7351); Manufacturer: Bel Fuse Inc.; PartNum: 507-1743-1-ND; Distributor: Digi-Key; PartName: 0ZCF0075AF2C
J1 J2 = Jumper: as J3 on sheet BACKPMAN21_CPU; Distributor: Future; Price: 0.02 Euro; PartNum: PH1-02-TA-HT; PartName: PH1-02-TA-HT
  J2: Price50: 0.02 Euro; Price100: 0.02 Euro; Price1000: 0.02 Euro
L1 = VLS4012ET-100M: 10uH, 890 mA, 0.228 Ohm, +-20%,- 40 C to + 105 C; Manufacturer: TDK Corporation; PartNum: 445-6681-1-ND; Tolerance: ±20%; Distributor: Mouser; PartName: VLS4012ET-100M
L4 = MPZ2012S601AT000: FERRITE BEAD 600 OHM, 0805, -55°C ~ 125°C; Manufacturer: TDK Corporation; PartNum: 445-2206-1-ND; Distributor: Digi-Key; Price: 0.05$; PartName: MPZ2012S601AT000
LCD1 = ER-OLED015-2W: 1.5"OLED Display Serial 128x64 Module,SSD1309,White on Black; Manufacturer: Orient Display; PartNum: 2544-AOM12864A0-1.54WW-ND; PartName: AOM12864A0-1.54WW; Distributor: Digi-Key
LED17 = SML-211UTT86: 0805 red LED, hibright, 2 mA, 1.8V, 130°; Manufacturer: Rohm; PartNum: 511-1292-1-ND; Distributor: Digi-Key; Price: 0.34$; Value: Red; PartName: SML-211UTT86
R2 = RC0603FR-070RL: as R6 on sheet BACKPMAN21_CPU; Distributor: Digi-Key; Price: 0.005$; PartName: RC0603FR-070RL
R3 = RMCF0603FT910K: 910 kOhms, ±1%, 0.1W, 1/10W, Thick Film, ±100ppm/°C, 0603 (1608 Metric), -55°C ~ 155°C, Automotive AEC-Q200; Manufacturer: Stackpole Electronics Inc.; PartNum: RMCF0603FT910KCT-ND; Voltage: 75V; Distributor: Digi-Key; Price: 0.00690; Tolerance: ±1%; PartName: RMCF0603FT910K; Part Number: RMCF0603FT910K; Temperature Coefficient: ±100ppm/°C; Operating Temperature: -55°C ~ 155°C; Power (Watts): 0.1W, 1/10W; Features: Automotive AEC-Q200; Package / Case: 0603 (1608 Metric)
R4 = RMCF0603FT220K: 220 kOhms, ±1%, 0.1W, 1/10W, Thick Film, ±100ppm/°C, 0603 (1608 Metric), -55°C ~ 155°C, Automotive AEC-Q200; Manufacturer: Stackpole Electronics Inc.; PartNum: RMCF0603FT220KCT-ND; Voltage: 75V; Distributor: Digi-Key; Price: 0.00690; Tolerance: ±1%; PartName: RMCF0603FT220K; Part Number: RMCF0603FT220K; Temperature Coefficient: ±100ppm/°C; Operating Temperature: -55°C ~ 155°C; Power (Watts): 0.1W, 1/10W; Features: Automotive AEC-Q200; Package / Case: 0603 (1608 Metric)
R5 = RMCF0603FT24K9: 24.9 kOhms, ±1%, 0.1W, 1/10W, Thick Film, ±100ppm/°C, 0603 (1608 Metric), -55°C ~ 155°C, Automotive AEC-Q200; Manufacturer: Stackpole Electronics Inc.; PartNum: RMCF0603FT24K9CT-ND; Voltage: 75V; Distributor: Digi-Key; Price: 0.00690; Tolerance: ±1%; PartName: RMCF0603FT24K9; Part Number: RMCF0603FT24K9; Temperature Coefficient: ±100ppm/°C; Operating Temperature: -55°C ~ 155°C; Power (Watts): 0.1W, 1/10W; Features: Automotive AEC-Q200; Package / Case: 0603 (1608 Metric)
R8 R15 R16 = RMCF0603FT120R: 120 Ohms, ±1%, 0.1W, 1/10W, Thick Film, ±100ppm/°C, 0603 (1608 Metric), -55°C ~ 155°C, Automotive AEC-Q200; Manufacturer: Stackpole Electronics Inc.; PartNum: RMCF0603FT120RCT-ND; Voltage: 75V; Distributor: Digi-Key; Price: 0.00690; Tolerance: ±1%; PartName: RMCF0603FT120R; Part Number: RMCF0603FT120R; Temperature Coefficient: ±100ppm/°C; Operating Temperature: -55°C ~ 155°C; Power (Watts): 0.1W, 1/10W; Features: Automotive AEC-Q200; Package / Case: 0603 (1608 Metric)
R10-R14 R17 = RL0603K010-1: as R1 on sheet BACKPMAN21_CPU; Distributor: Schukat; Price: 0.002 Euro; Tolerance: 1%; PartNum: RL0603K010-1
R49 = RL0603E120-1: 120 R, 1%, 0603, SMD Resistor, Taped; Manufacturer: Vishay; Voltage: 75 V; Distributor: Schukat; Tolerance: ±1%; PartNum: RL0603E120; PartName: RL0603E120
R50 = CRCW0603300RFKEA: 300 R, 1%, 0.1 W, 0603, SMD Resistor, Taped; Manufacturer: Vishay/Dale; PartNum: 541-300HDKR-ND; Voltage: 75 V; Distributor: DigiKey; Price: 0.017$; Tolerance: 1%; PartName: CRCW0603300RFKEA
R106 R107 = RT0603BRD07100KL: 100 kOhms, ±0.1%, 0.1W, 1/10W, Thin Film, ±25ppm/°C, 0603 (1608 Metric), -55°C ~ 155°C, -; Manufacturer: Yageo; PartNum: YAG1235CT-ND; Voltage: 75V; Distributor: Digi-Key; Price: 0.274; Tolerance: ±0.1%; PartName: RT0603BRD07100KL; Part Number: RT0603BRD07100KL; Temperature Coefficient: ±25ppm/°C; Operating Temperature: -55°C ~ 155°C; Power (Watts): 0.1W, 1/10W; Features: -; Package / Case: 0603 (1608 Metric)
R108 = RMCF0603FT100R: 100 Ohms, ±1%, 0.1W, 1/10W, Thick Film, ±100ppm/°C, 0603 (1608 Metric), -55°C ~ 155°C, Automotive AEC-Q200; Manufacturer: Stackpole Electronics Inc.; PartNum: RMCF0603FT100RCT-ND; Voltage: 75V; Distributor: Digi-Key; Price: 0.00690; Tolerance: ±1%; PartName: RMCF0603FT100R; Part Number: RMCF0603FT100R; Temperature Coefficient: ±100ppm/°C; Operating Temperature: -55°C ~ 155°C; Power (Watts): 0.1W, 1/10W; Features: Automotive AEC-Q200; Package / Case: 0603 (1608 Metric)
R116 R117 = RCV12062M00FKEA: 2 MOhms ±1% 0.25W, 1/4W Chip Resistor 1206 (3216 Metric) High Voltage Thick Film,-55°C ~ 155°C; Manufacturer: Vishay Dale; PartNum: BC2835CT-ND; Voltage: 2000V; Distributor: Digi-Key; Price: 0.29$; Tolerance: ±1%; PartName: RCV12062M00FKEA
SW1 = PEL12D-4225S-S2024: Rotary Encoder Mechanical 24 Quadrature (Incremental) Vertical; Manufacturer: Bourns Inc.; PartNum: PEL12D-4225S-S2024-ND; Distributor: Digi-Key; PartName: PEL12D-4225S-S2024; Price: 3.62$
U2 = MIC2250-1YD5-TR: Boost DC/DC, 2.5..5.5 to 1.24..32V, 900vA, 2.5Mhz, SOT-23-5, -40..+125 C; PartNum: 576-3967-1-ND; Manufacturer: Microchip Technology; Distributor: Digi-Key; PartName: MIC2250-1YD5-TR; Supplier 1: Digi-Key; Supplier Part Number 1: 576-3967-1-ND
U3 = ADM2483BRWZ: RS422, RS485 Digital Isolator 2500Vrms 3 Channel 500kbps 25kV/µs CMTI 16-SOIC, -40°C ~ 85°C; Manufacturer: Analog Divices; PartNum: ADM2483BRWZ-ND; Distributor: Digi-Key; Price: 6.25$; PartName: ADM2483BRWZ
U4 = RFMM-0505S: 1W DC-DC Unregulated Single Output , 5V in, 5 V out,  200mA, 4 kV, -40°C ~ 85°C; Manufacturer: Recom Power; PartNum: 945-3160-ND; Price: 1.7$; Distributor: Digi-Key; PartName: RFMM-0505S
U5 = RFMM-0505S: 1W DC-DC Unregulated Single Output , 5V in, 5 V out,  200mA, 4 kV, -40°C ~ 85°C; Manufacturer: Recom Power; Price: 1.7$; Distributor: Digi-Key; PartNum: 945-3160-ND; PartName: RFMM-0505S; Supplier 1: Digi-Key
U6 U8 = 74LVC1G17SE-7: IC SGL SCHMITT BUFFER SOT353; Manufacturer: Diodes Incorporated; PartNum: 74LVC1G17SE-7CT-ND; Distributor: Digi-Key; PartName: 74LVC1G17SE-7
U9 = VX7805-500: Linear Regulator Replacement DC DC Converter 1 Output 5V 500mA 6.5V - 36V Input; Manufacturer: CUI Inc.; PartNum: 102-4244-ND; Distributor: Digi-Key; price: 2.7$; PartName: VX7805-500
U10 = ADM3054BRWZ-RL7: IC Isol TXRX CAN HS 16SOIC; Manufacturer: Analog Divices; PartNum: ADM3054BRWZ-RL7CT-ND; Distributor: Digi-Key; PartName: ADM3054BRWZ-RL7
U11 = PUSBM5V5X4-TL,115: TVS DIODE 5.5VWM 12VC 6HXSON; Manufacturer: NXP Semiconductors; PartNum: 568-10921-1-ND; Distributor: Digi-Key; PartName: PUSBM5V5X4-TL,115
U12 = AP7361C-33SP-13: LDO, 3.3 V, 1A, 0.36V@1A, Vin=6V max, -40..+85C, 8-SO-EP; PartNum: AP7361C-33SP-13DICT-ND; Manufacturer: Diodes Incorporated; Distributor: Digi-Key; Price: 0.56$; PartName: AP7361C-33SP-13
U25 = LP5907QMFX-3.3Q1: LDO 3.3 V, 250 mA, Vin < 5.5V, Iq < 12uA, -40..+125 C, SOT23-5; Manufacturer: Texas Instruments; PartNum: 296-40365-1-ND; Distributor: Digi-Key; PartName: LP5907QMFX-3.3Q1; Supplier 1: Digi-Key; Supplier Part Number 1: 296-40365-1-ND
U26 = THS4281DBVR: Voltage Feedback Amplifier 1 Circuit Rail-to-Rail SOT-23-5; Manufacturer: Texas Instruments; PartNum: 296-39224-1-ND; Distributor: Digi-Key; PartName: THS4281DBVR; Supplier 1: Digi-Key; Supplier Part Number 1: 296-39224-1-ND
U34 = LMN200B02-7: Transistor Load Switch PNP Pre-Biased, N-Channel Pre-Biased 50V PNP, 60V N-Channel 200mA PNP, 115mA N-Channel Surface Mount SOT-363; Manufacturer: Diodes Incorporated; PartNum: LMN200B02DICT-ND; Distributor: Digi-Key; Price: 0.49$; PartName: LMN200B02-7; Supplier 1: Digi-Key; Supplier Part Number 1: LMN200B02DICT-ND
VD1 = CDSF4148: 150 mA, 75V, 1005, 125 C; Manufacturer: Comchip Technology; PartNum: 641-1004-1-ND; Distributor: Digi-Key; Price: 0.23$; PartName: CDSF4148
VD2 = SMAJ28A: DIODE TVS 28V 400W UNI 5% SMD; Manufacturer: Bourns Inc.; PartNum: SMAJ28ABCT-ND; Distributor: Digi-Key; Price: 0.18$; PartName: SMAJ28A; Value: 28 V
VD12 = SMBJ28CA: TVS 600W 28V Bidirectional; Manufacturer: Littelfuse; PartNum: SMBJ28CABCT-ND; Distributor: DigiKey; Price: 0.38$
X1 X2 = 1881561: Printed-circuit board connector - MCV 0,5/ 3-G-2,5 - 1881561; Manufacturer: Phoenix Contact; Distributor: Phoenix Contact; Price: 0.33; PartNum: 1881561; PartName: MCV 0,5/ 3-G-2,5
X3 X4 = MCV 1.5/3-G-3.5: HEADER, VERTICAL, 3.5MM, 3WAY; Manufacturer: PHOENIX CONTACT; PartNum: 1843619; PartName: MCV 1,5/3-G-3,5; Distributor: Farnell
X5 = SHF-105-01-L-D-SM: 10 Positions Header Connector 0.050" (1.27mm) Surface Mount Gold; Manufacturer: Samtec Inc.; PartName: SHF-105-01-L-D-SM
X19 = 10104110-0001LF: USB - micro B USB 2.0 Receptacle Connector 5 Position Surface Mount, Right Angle; Manufacturer: Amphenol FCI; PartNum: 609-4052-1-ND; Distributor: Digi-Key; Price: 0.79$; PartName: 10104110-0001LF
P1-P16 = Pin 0.9 mm: PartName: Pin 0.9 mm